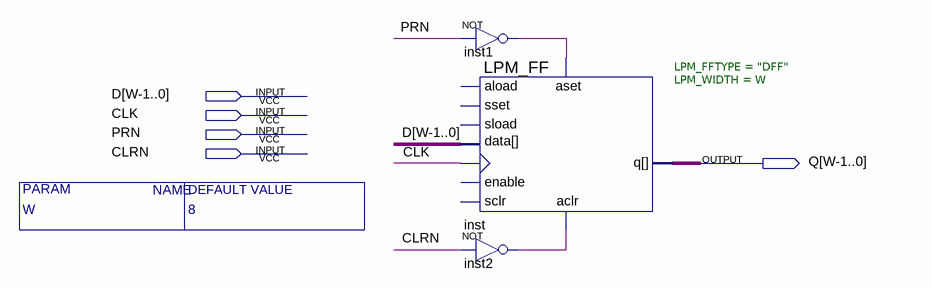
[diagram p0: schematic sheet]
// Quartus schematic reg.bdf as structural Verilog: 3 symbols, 5 pins
module \reg  #(parameter W = 8) (
  input  [7:0] D,
  input  CLK,
  input  PRN,
  input  CLRN,
  output [7:0] Q
);

  wire inst1_out, inst2_out;

  not inst1 (inst1_out, PRN);
  LPM_FF #(.LPM_FFTYPE("DFF"), .LPM_WIDTH(W)) inst (
    .clock(CLK), .aset(inst1_out), .aclr(inst2_out), .data(D), .q(Q));  // open: enable, aload, sset, sload, sclr
  not inst2 (inst2_out, CLRN);
endmodule
